# Altium schematic sheet stepperDrivers.SchDoc
size A3
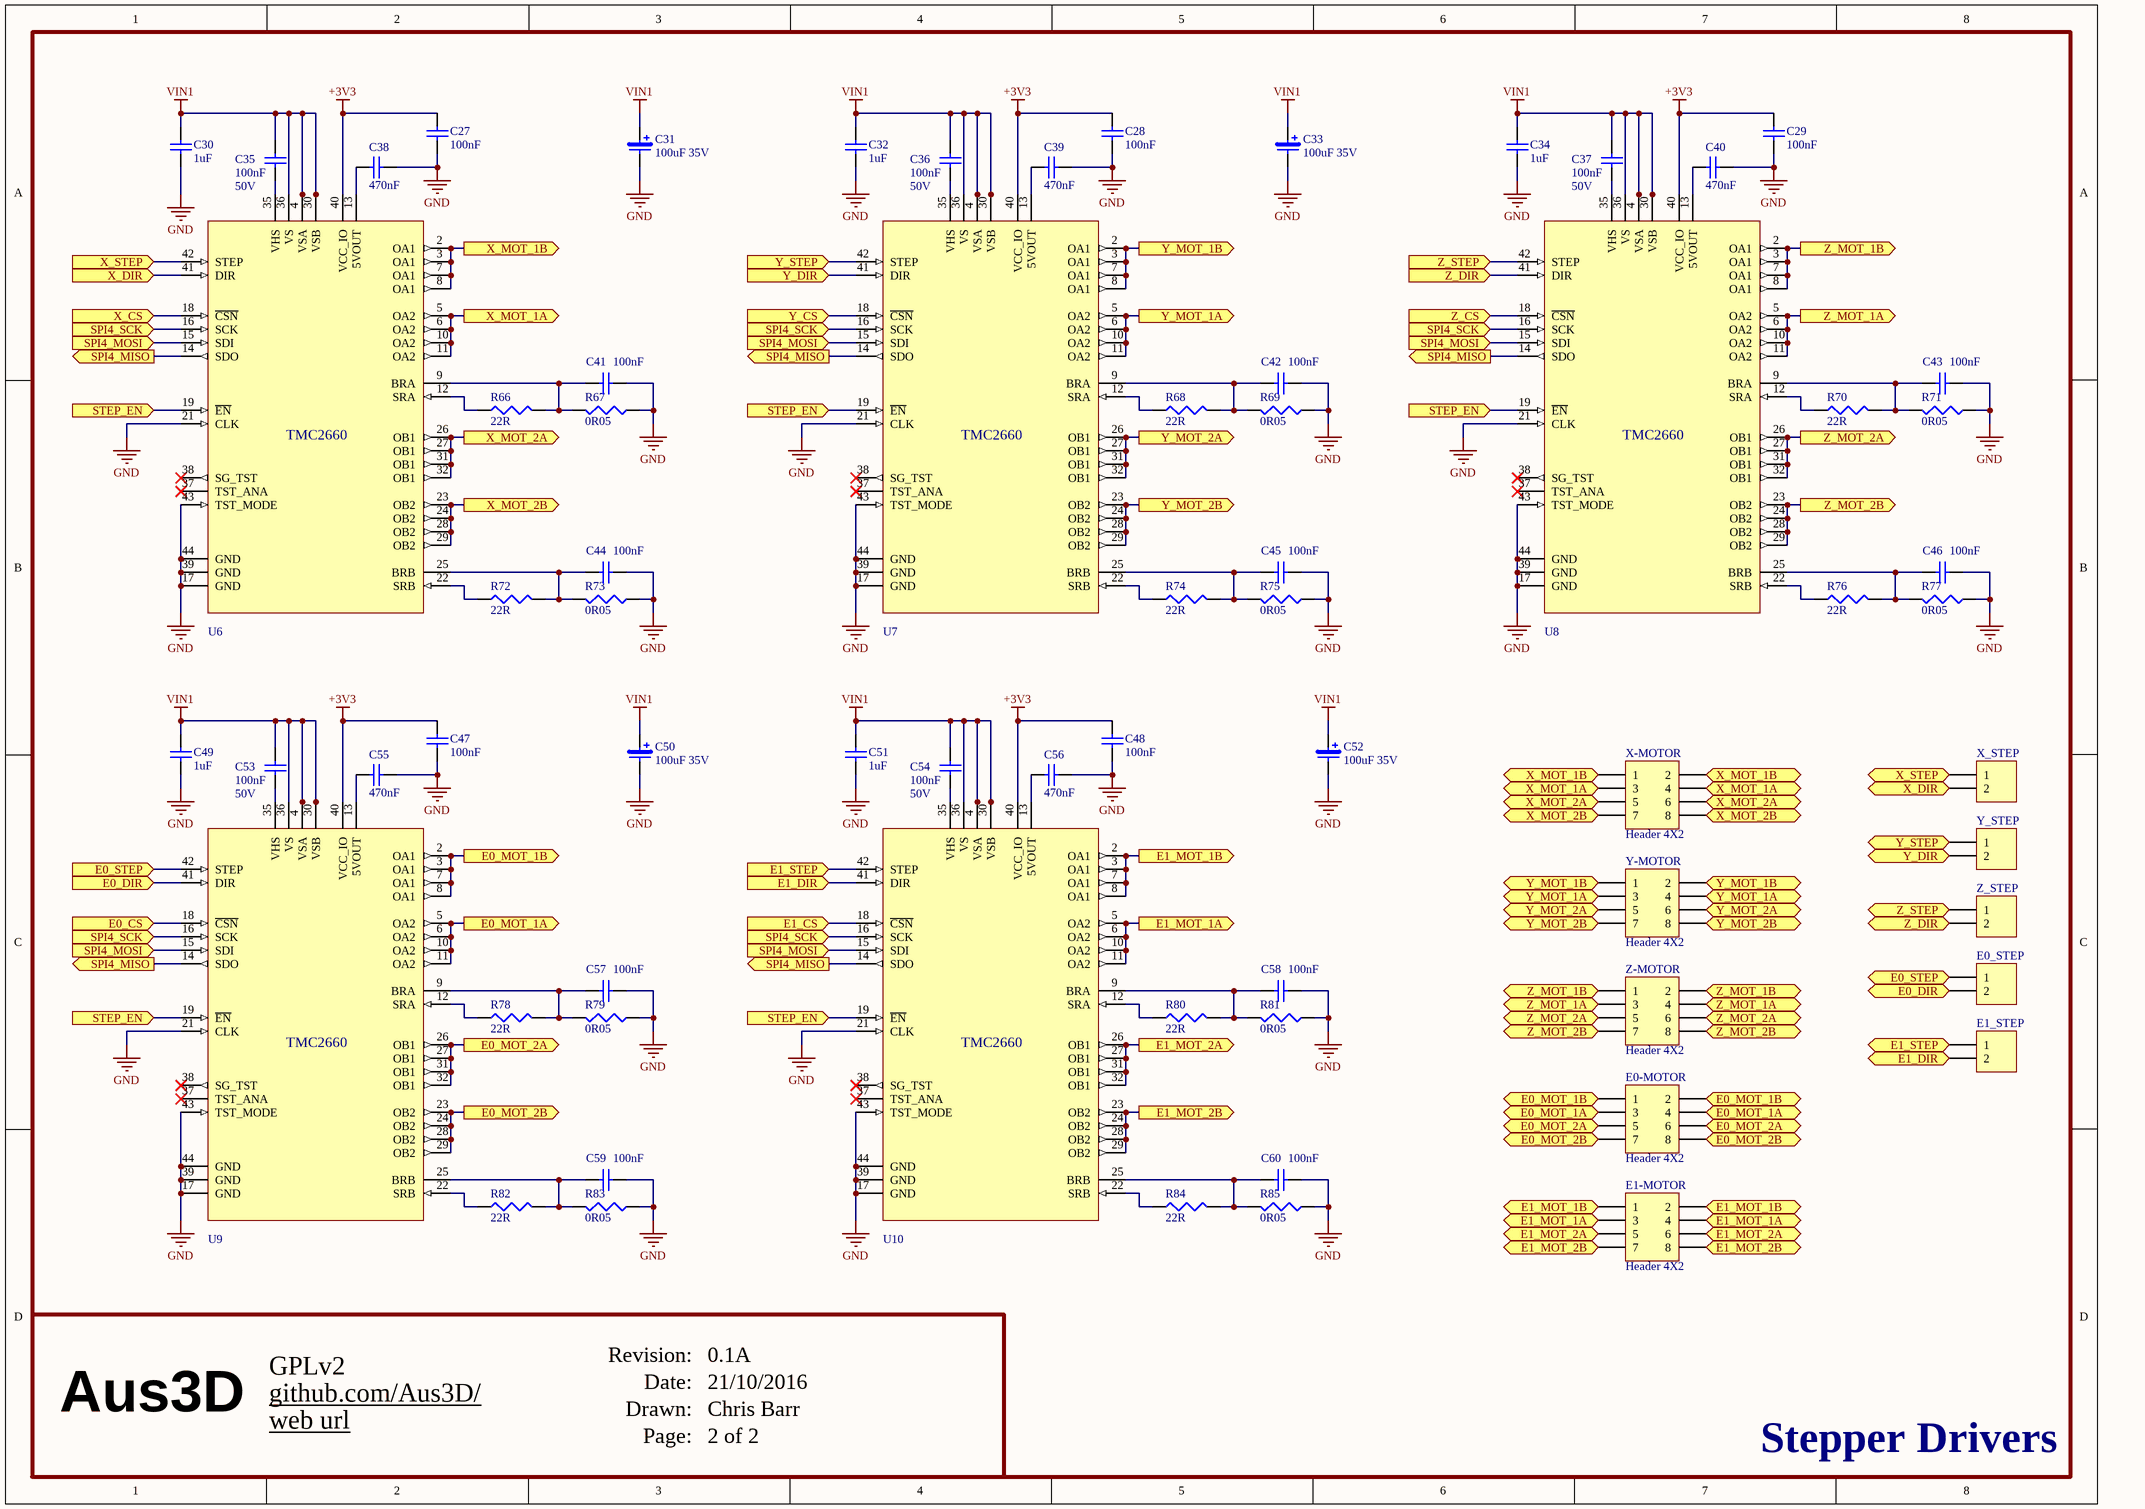
[diagram p0: stepperDrivers.SchDoc]

## Parts
C27  value 100nF  [CAP 1005-0402]  (hidden comment: CapC-0402-100nF)
C28  value 100nF  [CAP 1005-0402]  (hidden comment: CapC-0402-100nF)
C29  value 100nF  [CAP 1005-0402]  (hidden comment: CapC-0402-100nF)
C30  value 1uF  [Cap 1608-0603]  (hidden comment: CapC-0603-1uF 50V)
C31  value 100uF 35V  [CAP EL PANASONIC]  (hidden comment: CapE-6.3-100uF-35V)
C32  value 1uF  [Cap 1608-0603]  (hidden comment: CapC-0603-1uF 50V)
C33  value 100uF 35V  [CAP EL PANASONIC]  (hidden comment: CapE-6.3-100uF-35V)
C34  value 1uF  [Cap 1608-0603]  (hidden comment: CapC-0603-1uF 50V)
C35  value 100nF  Voltage: 50V  [CAP 1005-0402]  (hidden comment: CapC-0402-100nF-50V)
C36  value 100nF  Voltage: 50V  [CAP 1005-0402]  (hidden comment: CapC-0402-100nF-50V)
C37  value 100nF  Voltage: 50V  [CAP 1005-0402]  (hidden comment: CapC-0402-100nF-50V)
C38  value 470nF  [CAP 1005-0402]  (hidden comment: CapC-0402-470nF)
C39  value 470nF  [CAP 1005-0402]  (hidden comment: CapC-0402-470nF)
C40  value 470nF  [CAP 1005-0402]  (hidden comment: CapC-0402-470nF)
C41  value 100nF  [CAP 1005-0402]  (hidden comment: CapC-0402-100nF)
C42  value 100nF  [CAP 1005-0402]  (hidden comment: CapC-0402-100nF)
C43  value 100nF  [CAP 1005-0402]  (hidden comment: CapC-0402-100nF)
C44  value 100nF  [CAP 1005-0402]  (hidden comment: CapC-0402-100nF)
C45  value 100nF  [CAP 1005-0402]  (hidden comment: CapC-0402-100nF)
C46  value 100nF  [CAP 1005-0402]  (hidden comment: CapC-0402-100nF)
C47  value 100nF  [CAP 1005-0402]  (hidden comment: CapC-0402-100nF)
C48  value 100nF  [CAP 1005-0402]  (hidden comment: CapC-0402-100nF)
C49  value 1uF  [Cap 1608-0603]  (hidden comment: CapC-0603-1uF 50V)
C50  value 100uF 35V  [CAP EL PANASONIC]  (hidden comment: CapE-6.3-100uF-35V)
C51  value 1uF  [Cap 1608-0603]  (hidden comment: CapC-0603-1uF 50V)
C52  value 100uF 35V  [CAP EL PANASONIC]  (hidden comment: CapE-6.3-100uF-35V)
C53  value 100nF  Voltage: 50V  [CAP 1005-0402]  (hidden comment: CapC-0402-100nF-50V)
C54  value 100nF  Voltage: 50V  [CAP 1005-0402]  (hidden comment: CapC-0402-100nF-50V)
C55  value 470nF  [CAP 1005-0402]  (hidden comment: CapC-0402-470nF)
C56  value 470nF  [CAP 1005-0402]  (hidden comment: CapC-0402-470nF)
C57  value 100nF  [CAP 1005-0402]  (hidden comment: CapC-0402-100nF)
C58  value 100nF  [CAP 1005-0402]  (hidden comment: CapC-0402-100nF)
C59  value 100nF  [CAP 1005-0402]  (hidden comment: CapC-0402-100nF)
C60  value 100nF  [CAP 1005-0402]  (hidden comment: CapC-0402-100nF)
E0-MOTOR  Header 4X2  [HDR2X4-HEADER]
E0_STEP  Header 2  [HEADER-1x2-50mil]  (value not drawn)
E1-MOTOR  Header 4X2  [HDR2X4-HEADER]
E1_STEP  Header 2  [HEADER-1x2-50mil]  (value not drawn)
R66  value 22R  [RESC1005X40N]  (hidden comment: Res-0402-22R)
R67  value 0R05  [Res 3216-1206]  (hidden comment: Res-1206-0R05)
R68  value 22R  [RESC1005X40N]  (hidden comment: Res-0402-22R)
R69  value 0R05  [Res 3216-1206]  (hidden comment: Res-1206-0R05)
R70  value 22R  [RESC1005X40N]  (hidden comment: Res-0402-22R)
R71  value 0R05  [Res 3216-1206]  (hidden comment: Res-1206-0R05)
R72  value 22R  [RESC1005X40N]  (hidden comment: Res-0402-22R)
R73  value 0R05  [Res 3216-1206]  (hidden comment: Res-1206-0R05)
R74  value 22R  [RESC1005X40N]  (hidden comment: Res-0402-22R)
R75  value 0R05  [Res 3216-1206]  (hidden comment: Res-1206-0R05)
R76  value 22R  [RESC1005X40N]  (hidden comment: Res-0402-22R)
R77  value 0R05  [Res 3216-1206]  (hidden comment: Res-1206-0R05)
R78  value 22R  [RESC1005X40N]  (hidden comment: Res-0402-22R)
R79  value 0R05  [Res 3216-1206]  (hidden comment: Res-1206-0R05)
R80  value 22R  [RESC1005X40N]  (hidden comment: Res-0402-22R)
R81  value 0R05  [Res 3216-1206]  (hidden comment: Res-1206-0R05)
R82  value 22R  [RESC1005X40N]  (hidden comment: Res-0402-22R)
R83  value 0R05  [Res 3216-1206]  (hidden comment: Res-1206-0R05)
R84  value 22R  [RESC1005X40N]  (hidden comment: Res-0402-22R)
R85  value 0R05  [Res 3216-1206]  (hidden comment: Res-1206-0R05)
U6  TMC2660  [TQFP80P1200X1200X160-44N]  (value not drawn)
U7  TMC2660  [TQFP80P1200X1200X160-44N]  (value not drawn)
U8  TMC2660  [TQFP80P1200X1200X160-44N]  (value not drawn)
U9  TMC2660  [TQFP80P1200X1200X160-44N]  (value not drawn)
U10  TMC2660  [TQFP80P1200X1200X160-44N]  (value not drawn)
X-MOTOR  Header 4X2  [HDR2X4-HEADER]
X_STEP  Header 2  [HEADER-1x2-50mil]  (value not drawn)
Y-MOTOR  Header 4X2  [HDR2X4-HEADER]
Y_STEP  Header 2  [HEADER-1x2-50mil]  (value not drawn)
Z-MOTOR  Header 4X2  [HDR2X4-HEADER]
Z_STEP  Header 2  [HEADER-1x2-50mil]  (value not drawn)

## Ports
E0_CS (in), E0_DIR (in), E0_MOT_1A (in), E0_MOT_1A (out), E0_MOT_1B (in), E0_MOT_1B (out), E0_MOT_2A (in), E0_MOT_2A (out), E0_MOT_2B (in), E0_MOT_2B (out), E0_STEP (in), E1_CS (in), E1_DIR (in), E1_MOT_1A (in), E1_MOT_1A (out), E1_MOT_1B (in), E1_MOT_1B (out), E1_MOT_2A (in), E1_MOT_2A (out), E1_MOT_2B (in), E1_MOT_2B (out), E1_STEP (in), SPI4_MISO (out), SPI4_MOSI (in), SPI4_SCK (in), STEP_EN (in), X_CS (in), X_DIR (in), X_MOT_1A (in), X_MOT_1A (out), X_MOT_1B (in), X_MOT_1B (out), X_MOT_2A (in), X_MOT_2A (out), X_MOT_2B (in), X_MOT_2B (out), X_STEP (in), Y_CS (in), Y_DIR (in), Y_MOT_1A (in), Y_MOT_1A (out), Y_MOT_1B (in), Y_MOT_1B (out), Y_MOT_2A (in), Y_MOT_2A (out), Y_MOT_2B (in), Y_MOT_2B (out), Y_STEP (in), Z_CS (in), Z_DIR (in), Z_MOT_1A (in), Z_MOT_1A (out), Z_MOT_1B (in), Z_MOT_1B (out), Z_MOT_2A (in), Z_MOT_2A (out), Z_MOT_2B (in), Z_MOT_2B (out), Z_STEP (in)

## Nets
+3V3: C27.2 C28.2 C29.2 C47.2 C48.2 U6.40(VCC_IO) U7.40(VCC_IO) U8.40(VCC_IO) U9.40(VCC_IO) U10.40(VCC_IO)
GND: C27.1 C28.1 C29.1 C30.1 C31.2 C32.1 C33.2 C34.1 C38.1 C39.1 C40.1 C41.1 C42.1 C43.1 C44.1 C45.1 C46.1 C47.1 C48.1 C49.1 C50.2 C51.1 C52.2 C55.1 C56.1 C57.1 C58.1 C59.1 C60.1 R67.1 R69.1 R71.1 R73.1 R75.1 R77.1 R79.1 R81.1 R83.1 R85.1 U6.17(GND) U6.21(CLK) U6.39(GND) U6.43(TST_MODE) U6.44(GND) U7.17(GND) U7.21(CLK) U7.39(GND) U7.43(TST_MODE) U7.44(GND) U8.17(GND) U8.21(CLK) U8.39(GND) U8.43(TST_MODE) U8.44(GND) U9.17(GND) U9.21(CLK) U9.39(GND) U9.43(TST_MODE) U9.44(GND) U10.17(GND) U10.21(CLK) U10.39(GND) U10.43(TST_MODE) U10.44(GND)
VIN1: C30.2 C31.1 C32.2 C33.1 C34.2 C35.2 C36.2 C37.2 C49.2 C50.1 C51.2 C52.1 C53.2 C54.2 U6.1(NC) U6.4(VSA) U6.30(VSB) U6.33(NC) U6.36(VS) U7.1(NC) U7.4(VSA) U7.30(VSB) U7.33(NC) U7.36(VS) U8.1(NC) U8.4(VSA) U8.30(VSB) U8.33(NC) U8.36(VS) U9.1(NC) U9.4(VSA) U9.30(VSB) U9.33(NC) U9.36(VS) U10.1(NC) U10.4(VSA) U10.30(VSB) U10.33(NC) U10.36(VS)
E0_CS: U9.18(~{CSN}) ; port E0_CS
E0_DIR: E0_STEP.2 U9.41(DIR) ; port E0_DIR
E0_MOT_1A: E0-MOTOR.3 E0-MOTOR.4 U9.5(OA2) U9.6(OA2) U9.10(OA2) U9.11(OA2) ; port E0_MOT_1A
E0_MOT_1B: E0-MOTOR.1 E0-MOTOR.2 U9.2(OA1) U9.3(OA1) U9.7(OA1) U9.8(OA1) ; port E0_MOT_1B
E0_MOT_2A: E0-MOTOR.5 E0-MOTOR.6 U9.26(OB1) U9.27(OB1) U9.31(OB1) U9.32(OB1) ; port E0_MOT_2A
E0_MOT_2B: E0-MOTOR.7 E0-MOTOR.8 U9.23(OB2) U9.24(OB2) U9.28(OB2) U9.29(OB2) ; port E0_MOT_2B
E0_STEP: E0_STEP.1 U9.42(STEP) ; port E0_STEP
E1_CS: U10.18(~{CSN}) ; port E1_CS
E1_DIR: E1_STEP.2 U10.41(DIR) ; port E1_DIR
E1_MOT_1A: E1-MOTOR.3 E1-MOTOR.4 U10.5(OA2) U10.6(OA2) U10.10(OA2) U10.11(OA2) ; port E1_MOT_1A
E1_MOT_1B: E1-MOTOR.1 E1-MOTOR.2 U10.2(OA1) U10.3(OA1) U10.7(OA1) U10.8(OA1) ; port E1_MOT_1B
E1_MOT_2A: E1-MOTOR.5 E1-MOTOR.6 U10.26(OB1) U10.27(OB1) U10.31(OB1) U10.32(OB1) ; port E1_MOT_2A
E1_MOT_2B: E1-MOTOR.7 E1-MOTOR.8 U10.23(OB2) U10.24(OB2) U10.28(OB2) U10.29(OB2) ; port E1_MOT_2B
E1_STEP: E1_STEP.1 U10.42(STEP) ; port E1_STEP
SPI4_MISO: U6.14(SDO) U7.14(SDO) U8.14(SDO) U9.14(SDO) U10.14(SDO) ; port SPI4_MISO
SPI4_MOSI: U6.15(SDI) U7.15(SDI) U8.15(SDI) U9.15(SDI) U10.15(SDI) ; port SPI4_MOSI
SPI4_SCK: U6.16(SCK) U7.16(SCK) U8.16(SCK) U9.16(SCK) U10.16(SCK) ; port SPI4_SCK
STEP_EN: U6.19(~{EN}) U7.19(~{EN}) U8.19(~{EN}) U9.19(~{EN}) U10.19(~{EN}) ; port STEP_EN
X_CS: U6.18(~{CSN}) ; port X_CS
X_DIR: U6.41(DIR) X_STEP.2 ; port X_DIR
X_MOT_1A: U6.5(OA2) U6.6(OA2) U6.10(OA2) U6.11(OA2) X-MOTOR.3 X-MOTOR.4 ; port X_MOT_1A
X_MOT_1B: U6.2(OA1) U6.3(OA1) U6.7(OA1) U6.8(OA1) X-MOTOR.1 X-MOTOR.2 ; port X_MOT_1B
X_MOT_2A: U6.26(OB1) U6.27(OB1) U6.31(OB1) U6.32(OB1) X-MOTOR.5 X-MOTOR.6 ; port X_MOT_2A
X_MOT_2B: U6.23(OB2) U6.24(OB2) U6.28(OB2) U6.29(OB2) X-MOTOR.7 X-MOTOR.8 ; port X_MOT_2B
X_STEP: U6.42(STEP) X_STEP.1 ; port X_STEP
Y_CS: U7.18(~{CSN}) ; port Y_CS
Y_DIR: U7.41(DIR) Y_STEP.2 ; port Y_DIR
Y_MOT_1A: U7.5(OA2) U7.6(OA2) U7.10(OA2) U7.11(OA2) Y-MOTOR.3 Y-MOTOR.4 ; port Y_MOT_1A
Y_MOT_1B: U7.2(OA1) U7.3(OA1) U7.7(OA1) U7.8(OA1) Y-MOTOR.1 Y-MOTOR.2 ; port Y_MOT_1B
Y_MOT_2A: U7.26(OB1) U7.27(OB1) U7.31(OB1) U7.32(OB1) Y-MOTOR.5 Y-MOTOR.6 ; port Y_MOT_2A
Y_MOT_2B: U7.23(OB2) U7.24(OB2) U7.28(OB2) U7.29(OB2) Y-MOTOR.7 Y-MOTOR.8 ; port Y_MOT_2B
Y_STEP: U7.42(STEP) Y_STEP.1 ; port Y_STEP
Z_CS: U8.18(~{CSN}) ; port Z_CS
Z_DIR: U8.41(DIR) Z_STEP.2 ; port Z_DIR
Z_MOT_1A: U8.5(OA2) U8.6(OA2) U8.10(OA2) U8.11(OA2) Z-MOTOR.3 Z-MOTOR.4 ; port Z_MOT_1A
Z_MOT_1B: U8.2(OA1) U8.3(OA1) U8.7(OA1) U8.8(OA1) Z-MOTOR.1 Z-MOTOR.2 ; port Z_MOT_1B
Z_MOT_2A: U8.26(OB1) U8.27(OB1) U8.31(OB1) U8.32(OB1) Z-MOTOR.5 Z-MOTOR.6 ; port Z_MOT_2A
Z_MOT_2B: U8.23(OB2) U8.24(OB2) U8.28(OB2) U8.29(OB2) Z-MOTOR.7 Z-MOTOR.8 ; port Z_MOT_2B
Z_STEP: U8.42(STEP) Z_STEP.1 ; port Z_STEP
NetC35_1: C35.1 U6.35(VHS)
NetC36_1: C36.1 U7.35(VHS)
NetC37_1: C37.1 U8.35(VHS)
NetC38_2: C38.2 U6.13(5VOUT)
NetC39_2: C39.2 U7.13(5VOUT)
NetC40_2: C40.2 U8.13(5VOUT)
NetC41_2: C41.2 R66.2 R67.2 U6.9(BRA)
NetC42_2: C42.2 R68.2 R69.2 U7.9(BRA)
NetC43_2: C43.2 R70.2 R71.2 U8.9(BRA)
NetC44_2: C44.2 R72.2 R73.2 U6.25(BRB)
NetC45_2: C45.2 R74.2 R75.2 U7.25(BRB)
NetC46_2: C46.2 R76.2 R77.2 U8.25(BRB)
NetC53_1: C53.1 U9.35(VHS)
NetC54_1: C54.1 U10.35(VHS)
NetC55_2: C55.2 U9.13(5VOUT)
NetC56_2: C56.2 U10.13(5VOUT)
NetC57_2: C57.2 R78.2 R79.2 U9.9(BRA)
NetC58_2: C58.2 R80.2 R81.2 U10.9(BRA)
NetC59_2: C59.2 R82.2 R83.2 U9.25(BRB)
NetC60_2: C60.2 R84.2 R85.2 U10.25(BRB)
NetR66_1: R66.1 U6.12(SRA)
NetR68_1: R68.1 U7.12(SRA)
NetR70_1: R70.1 U8.12(SRA)
NetR72_1: R72.1 U6.22(SRB)
NetR74_1: R74.1 U7.22(SRB)
NetR76_1: R76.1 U8.22(SRB)
NetR78_1: R78.1 U9.12(SRA)
NetR80_1: R80.1 U10.12(SRA)
NetR82_1: R82.1 U9.22(SRB)
NetR84_1: R84.1 U10.22(SRB)

Not connected (* = marked no-connect by the designer): U6 37(TST_ANA)* 38(SG_TST)*; U7 37(TST_ANA)* 38(SG_TST)*; U8 37(TST_ANA)* 38(SG_TST)*; U9 37(TST_ANA)* 38(SG_TST)*; U10 37(TST_ANA)* 38(SG_TST)*

## Notes on the sheet
- GPLv2
- Date:
- Revision:
- 0.1A
- 21/10/2016
- Aus3D
- github.com/Aus3D/
- web url
- Drawn:
- Page:
- Chris Barr
- 2 of 2
- Stepper Drivers

## Library data of the parts
C27-C29 C41-C48 C57-C60 = CapC-0402-100nF: Capacitor (Semiconductor SIM Model); Note: Approved sub OK; Published: 8-Jun-2000; Revision: July-2002: Re-released for DXP Platform.; Publisher: Altium Limited; Supplier 1: Digi-Key; Supplier Part Number 1: 311-1336-1-ND
C30 C32 C34 C49 C51 = CapC-0603-1uF 50V: Capacitor (Semiconductor SIM Model); Note: Approved sub OK; Published: 8-Jun-2000; Revision: July-2002: Re-released for DXP Platform.; Publisher: Altium Limited; Supplier 1: Digi-Key; Supplier Part Number 1: 1276-1860-1-ND
C31 C33 C50 C52 = CapE-6.3-100uF-35V: Polarized Capacitor (Surface Mount); Note: Approved sub OK; Published: 8-Jun-2000; Revision: July-2002: Re-released for DXP Platform.; Publisher: Altium Limited; Supplier 1: Digi-Key; Supplier Part Number 1: PCE5016CT-ND
C35-C37 C53 C54 = CapC-0402-100nF-50V: Capacitor (Semiconductor SIM Model); Note: Approved sub OK; Published: 8-Jun-2000; Revision: July-2002: Re-released for DXP Platform.; Publisher: Altium Limited; Supplier 1: Digi-Key; Supplier Part Number 1: 490-10700-1-ND
C38-C40 C55 C56 = CapC-0402-470nF: Capacitor (Semiconductor SIM Model); Note: Approved sub OK; Published: 8-Jun-2000; Revision: July-2002: Re-released for DXP Platform.; Publisher: Altium Limited; Supplier 1: Digi-Key; Supplier Part Number 1: 1276-1173-1-ND
E0-MOTOR E1-MOTOR X-MOTOR Y-MOTOR Z-MOTOR = Header 4X2: Header, 4-Pin, Dual row; Note: Approved sub OK; LatestRevisionDate: 17-Jul-2002; LatestRevisionNote: Re-released for DXP Platform.; Publisher: Altium Limited; Supplier 1: Digi-Key; Supplier Part Number 1: 961208-6404-AR-ND
E0_STEP E1_STEP X_STEP Y_STEP Z_STEP = Header 2: Header, 2-Pin; Note: Approved sub OK; LatestRevisionDate: 17-Jul-2002; LatestRevisionNote: Re-released for DXP Platform.; Publisher: Altium Limited; Supplier 1: Digi-Key; Supplier Part Number 1: 3M9447-ND
R66 R68 R70 R72 R74 R76 R78 R80 R82 R84 = Res-0402-22R: Resistor; Note: Approved sub OK; Published: 8-Jun-2000; Revision: July-2002: Re-released for DXP Platform.; Publisher: Altium Limited; Supplier 1: Digi-Key; Supplier Part Number 1: 311-22JRCT-ND
R67 R69 R71 R73 R75 R77 R79 R81 R83 R85 = Res-1206-0R05: Resistor; Note: Approved sub OK; Published: 8-Jun-2000; Revision: July-2002: Re-released for DXP Platform.; Publisher: Altium Limited; Supplier 1: Digi-Key; Supplier Part Number 1: 73E4R050JCT-ND
U6-U10 = TMC2660: Stepper Driver IC; Supplier 1: Digi-Key; Supplier Part Number 1: 1460-1062-1-ND